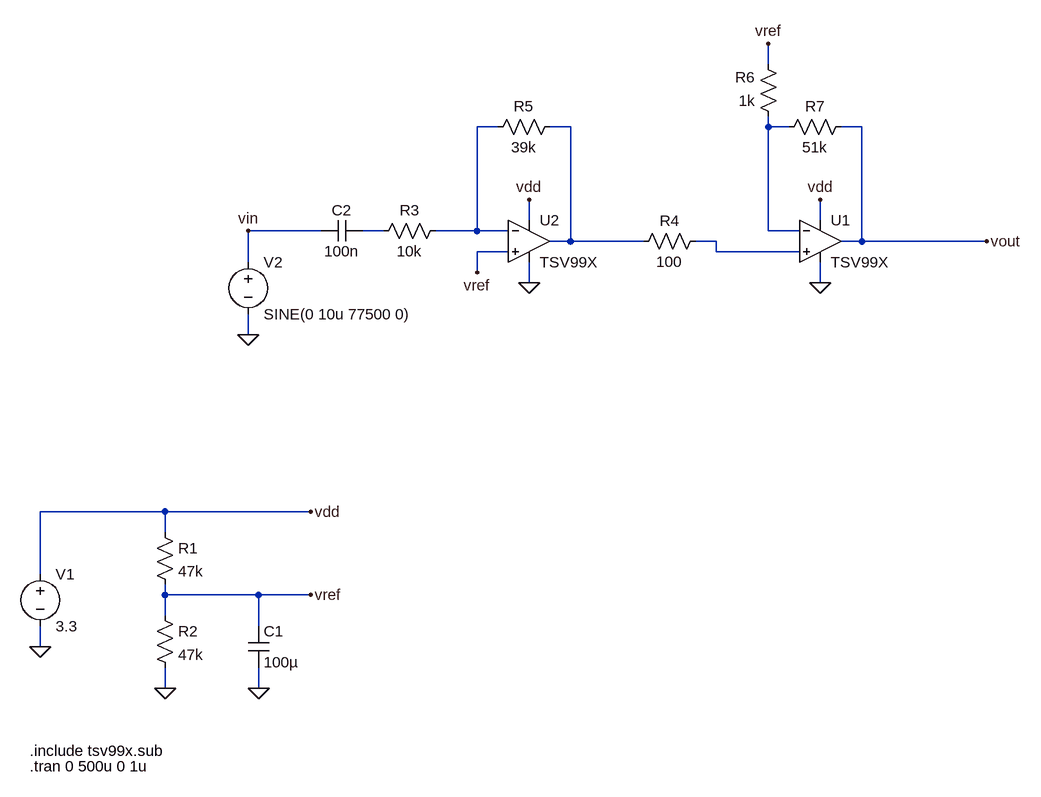
[diagram p0: schematic preamp.asc]
preamp.asc, the LTspice schematic file:
Version 4
SHEET 1 2244 744
WIRE 1072 -352 1072 -384
WIRE 656 -256 624 -256
WIRE 768 -256 736 -256
WIRE 1072 -256 1072 -272
WIRE 1104 -256 1072 -256
WIRE 1216 -256 1184 -256
WIRE 704 -112 704 -144
WIRE 1152 -112 1152 -144
WIRE 384 -96 272 -96
WIRE 480 -96 448 -96
WIRE 624 -96 624 -256
WIRE 624 -96 560 -96
WIRE 672 -96 624 -96
WIRE 1072 -96 1072 -256
WIRE 1120 -96 1072 -96
WIRE 768 -80 768 -256
WIRE 768 -80 736 -80
WIRE 880 -80 768 -80
WIRE 992 -80 960 -80
WIRE 1216 -80 1216 -256
WIRE 1216 -80 1184 -80
WIRE 1408 -80 1216 -80
WIRE 672 -64 624 -64
WIRE 992 -64 992 -80
WIRE 1120 -64 992 -64
WIRE 272 -48 272 -96
WIRE 624 -32 624 -64
WIRE 704 -16 704 -48
WIRE 1152 -16 1152 -48
WIRE 272 64 272 32
WIRE 144 336 -48 336
WIRE 368 336 144 336
WIRE 144 368 144 336
WIRE -48 432 -48 336
WIRE 144 464 144 448
WIRE 288 464 144 464
WIRE 368 464 288 464
WIRE 144 496 144 464
WIRE 288 512 288 464
WIRE -48 544 -48 512
WIRE 144 608 144 576
WIRE 288 608 288 576
FLAG -48 544 0
FLAG 144 608 0
FLAG 368 464 vref
FLAG 288 608 0
FLAG 368 336 vdd
FLAG 704 -16 0
FLAG 704 -144 vdd
FLAG 1152 -16 0
FLAG 1152 -144 vdd
FLAG 1072 -384 vref
FLAG 272 -96 vin
FLAG 1408 -80 vout
FLAG 624 -32 vref
FLAG 272 64 0
DATAFLAG 1328 -80 ""
SYMBOL voltage -48 416 R0
WINDOW 123 0 0 Left 0
WINDOW 39 0 0 Left 0
SYMATTR InstName V1
SYMATTR Value 3.3
SYMBOL res 128 352 R0
SYMATTR InstName R1
SYMATTR Value 47k
SYMBOL OpAmps\\opamp2 704 -144 R0
SYMATTR InstName U2
SYMATTR Value TSV99X
SYMBOL res 128 480 R0
SYMATTR InstName R2
SYMATTR Value 47k
SYMBOL cap 272 512 R0
SYMATTR InstName C1
SYMATTR Value 100µ
SYMBOL res 576 -112 R90
WINDOW 0 0 56 VBottom 2
WINDOW 3 32 56 VTop 2
SYMATTR InstName R3
SYMATTR Value 10k
SYMBOL cap 448 -112 R90
WINDOW 0 0 32 VBottom 2
WINDOW 3 32 32 VTop 2
SYMATTR InstName C2
SYMATTR Value 100n
SYMBOL res 752 -272 R90
WINDOW 0 0 56 VBottom 2
WINDOW 3 32 56 VTop 2
SYMATTR InstName R5
SYMATTR Value 39k
SYMBOL OpAmps\\opamp2 1152 -144 R0
SYMATTR InstName U1
SYMATTR Value TSV99X
SYMBOL res 1088 -256 R180
WINDOW 0 36 76 Left 2
WINDOW 3 36 40 Left 2
SYMATTR InstName R6
SYMATTR Value 1k
SYMBOL res 1200 -272 R90
WINDOW 0 0 56 VBottom 2
WINDOW 3 32 56 VTop 2
SYMATTR InstName R7
SYMATTR Value 51k
SYMBOL res 976 -96 R90
WINDOW 0 0 56 VBottom 2
WINDOW 3 32 56 VTop 2
SYMATTR InstName R4
SYMATTR Value 100
SYMBOL voltage 272 -64 R0
WINDOW 123 0 0 Left 0
WINDOW 39 0 0 Left 0
SYMATTR InstName V2
SYMATTR Value SINE(0 10u 77500 0)
TEXT -64 704 Left 2 !.include tsv99x.sub
TEXT -64 728 Left 2 !.tran 0 500u 0 1u

The netlist it stands for:
* preamp.asc
V1 vdd 0 3.3
R1 vdd vref 47k
XU2 vref N001 vdd 0 N002 TSV99X  ; pins In+ In- V+ V- OUT
R2 vref 0 47k
C1 vref 0 100µ
R3 N001 N004 10k
C2 N004 vin 100n
R5 N002 N001 39k
XU1 N005 N003 vdd 0 vout TSV99X  ; pins In+ In- V+ V- OUT
R6 N003 vref 1k
R7 vout N003 51k
R4 N005 N002 100
V2 vin 0 SINE(0 10u 77500 0)
.include tsv99x.sub
.tran 0 500u 0 1u
.backanno
.end